# Altium project Projet M1S1 ceinture.PrjPcb
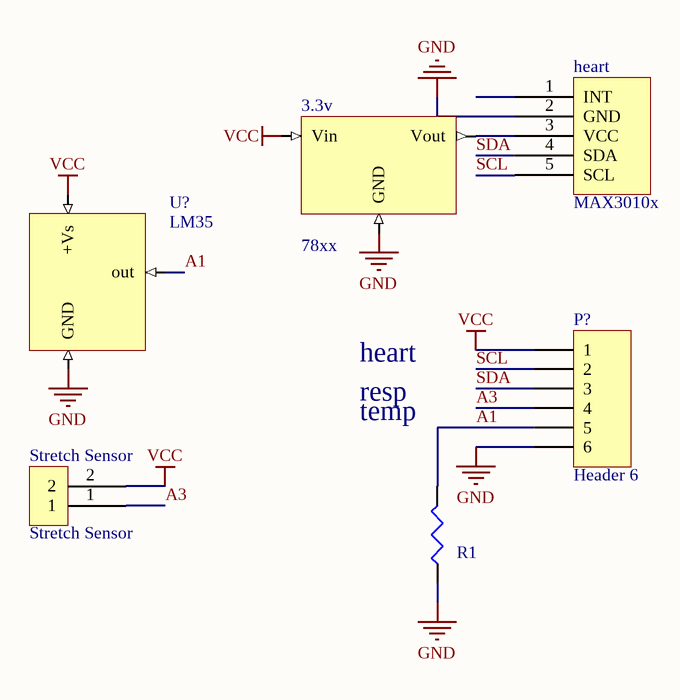
[diagram p0: Projet M1S1 ceinture.SchDoc]
1 sheet, 6 parts. Net scope: global (net labels, ports and power ports of the same name join across sheets).
Board file: Projet M1S1 ceinture.PCBDOC

## Sheet Projet M1S1 ceinture.SchDoc
size A4

### Parts
3.3v  78xx  [TO252]
heart  MAX3010x  [MAX30100 maxim]
P?  Header 6  [HDR1X6]
R1  RES  [0805]  (value not drawn)
Stretch_Sensor  Stretch Sensor  [Stretch Sensor]
U?  LM35  [Z03A]

### Nets
GND: 3.3v.2(GND) heart.2(GND) P?.6 R1.1 U?.3(GND)
VCC: 3.3v.1(Vin) P?.1 Stretch_Sensor.2 U?.1(+Vs)
A1: P?.5 R1.2 U?.2(out)
A3: P?.4 Stretch_Sensor.1
SCL: heart.5(SCL) P?.2
SDA: heart.4(SDA) P?.3
Net3.3v_3: 3.3v.3(Vout) heart.3(VCC)

Not connected (* = marked no-connect by the designer): heart 1(INT)

### Notes on the sheet
- heart
- temp
- resp

### Library data of the parts
3.3v = REG_POS: régulateur positif fixe
heart = MAX3010x: Heart rate and SpO2 sensor
P? = Header 6: Header, 6-Pin; LatestRevisionDate: 17-Jul-2002; LatestRevisionNote: Re-released for DXP Platform.; Publisher: Altium Limited
R1 = RES: resistance